# Altium schematic sheet [05]Motor.SchDoc
size A
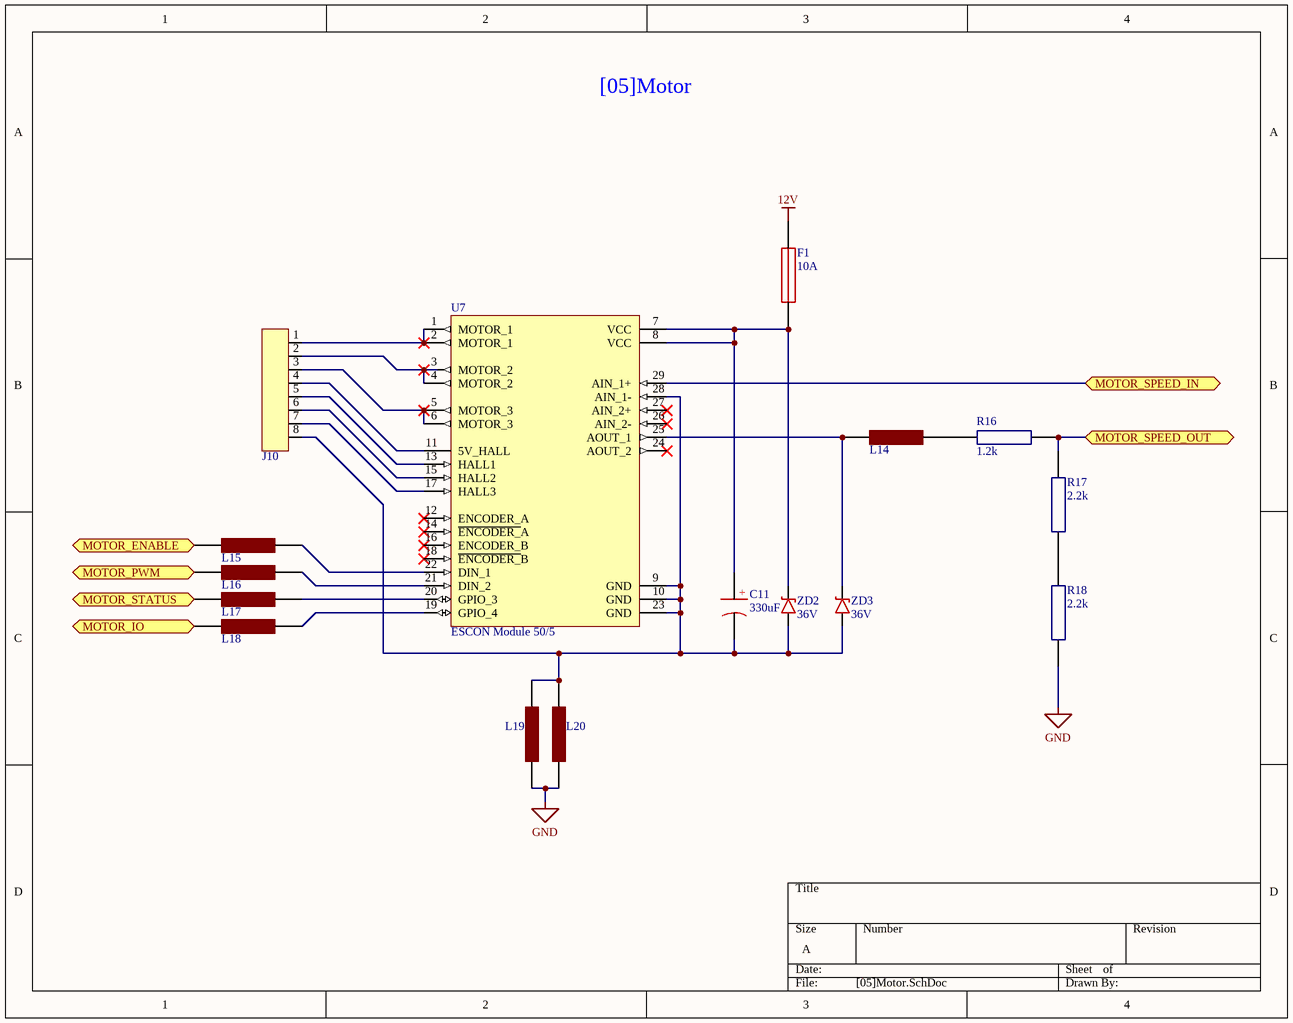
[diagram p0: [05]Motor.SchDoc]

## Parts
C11  330uF  [CAPAE137130X140M]
F1  10A  [0157004.DR]
J10  1771156  [1771156]  (value not drawn)
L14  MH2029-300Y  [INDC2012X11N]  (value not drawn)
L15  MH2029-300Y  [INDC2012X11N]  (value not drawn)
L16  MH2029-300Y  [INDC2012X11N]  (value not drawn)
L17  MH2029-300Y  [INDC2012X11N]  (value not drawn)
L18  MH2029-300Y  [INDC2012X11N]  (value not drawn)
L19  MH2029-300Y  [INDC2012X11N]  (value not drawn)
L20  MH2029-300Y  [INDC2012X11N]  (value not drawn)
R16  1.2k  [RESC2012X07N_SAMSUNG]
R17  2.2k  [RESC2012X07N_SAMSUNG]
R18  2.2k  [RESC2012X07N_SAMSUNG]
U7  ESCON Module 50/5  [ESCON Module 50/5 SMD]
ZD2  36V  [SOT95P237X111-3N]
ZD3  36V  [SOT95P237X111-3N]

## Ports
MOTOR_ENABLE (bidir), MOTOR_IO (bidir), MOTOR_PWM (bidir), MOTOR_SPEED_IN (bidir), MOTOR_SPEED_OUT (bidir), MOTOR_STATUS (bidir)

## Nets
12V: F1.2
GND: L19.2 L20.1 R18.1
MOTOR_ENABLE: L15.1 ; port MOTOR_ENABLE
MOTOR_IO: L18.1 ; port MOTOR_IO
MOTOR_PWM: L16.1 ; port MOTOR_PWM
MOTOR_SPEED_IN: U7.29(AIN_1+) ; port MOTOR_SPEED_IN
MOTOR_SPEED_OUT: R16.1 R17.2 ; port MOTOR_SPEED_OUT
MOTOR_STATUS: L17.1 ; port MOTOR_STATUS
NetC11_1: C11.1 F1.1 U7.7(VCC) U7.8(VCC) ZD2.K
NetC11_2: C11.2 J10.8 L19.1 L20.2 U7.9(GND) U7.10(GND) U7.23(GND) U7.28(AIN_1-) ZD2.A ZD3.A
NetJ10_1: J10.1 U7.1(MOTOR_1) U7.2(MOTOR_1)
NetJ10_2: J10.2 U7.3(MOTOR_2) U7.4(MOTOR_2)
NetJ10_3: J10.3 U7.5(MOTOR_3) U7.6(MOTOR_3)
NetJ10_4: J10.4 U7.11(5V_HALL)
NetJ10_5: J10.5 U7.13(HALL1)
NetJ10_6: J10.6 U7.15(HALL2)
NetJ10_7: J10.7 U7.17(HALL3)
NetL14_1: L14.1 U7.25(AOUT_1) ZD3.K
NetL14_2: L14.2 R16.2
NetL15_2: L15.2 U7.22(DIN_1)
NetL16_2: L16.2 U7.21(DIN_2)
NetL17_2: L17.2 U7.20(GPIO_3)
NetL18_2: L18.2 U7.19(GPIO_4)
NetR17_1: R17.1 R18.2

Not connected (* = marked no-connect by the designer): U7 12(ENCODER_A)* 14(~{ENCODER_}A)* 16(ENCODER_B)* 18(~{ENCODER_}B)* 24(AOUT_2)* 26(AIN_2-)* 27(AIN_2+)*

## Notes on the sheet
- [05]Motor
- (in symbol EMVH350ARA331MKE0S) +

## Library data of the parts
C11 = EMVH350ARA331MKE0S: CAP ALUM 330UF 20% 35V SMD; Supplier 1: Digi-Key; Supplier Part Number 1: 565-2316-1-ND
F1 = 0157010.DR: FUSE BRD MNT 10A 125VAC/VDC SMD; Manufacturer: Littelfuse Inc.; Fuse Type: Board Mount (Cartridge Style Excluded); Response Time: Fast; Breaking Capacity @ Rated Voltage: 35A AC, 50A DC; Approvals: cULus, PSE; Supplier 1: Digi-Key; Manufacturer Part Number: 0157010.DR; RoHS: RoHS Compliant; Category: Circuit Protection; Stock 1: 6229; Pricing 1: 1=2.73, 5=2.6, 10=2.47, 50=1.9936, 100=1.6903, 250=1.64692, 500=1.38688 (USD); Packaging: Cut Tape (CT); Part Status: Active; Package / Case: 2-SMD, Square End Block with Clip; Mounting Type: Holder, Surface Mount; Operating Temperature: -55°C ~ 125°C; Color: -; Size / Dimension: 0.256" L x 0.146" W x 0.154" H (6.50mm x 3.70mm x 3.90mm); ComponentLink1URL: http://www.littelfuse.com/products/fuse-blocks-fuseholders-and-fuse-accessories/fuse-clips/~/media/electronics/datasheets/fuses/littelfuse_fuse_157_datasheet.pdf.pdf; ComponentLink1Description: http://www.littelfuse.com/products/fuse-blocks-fuseholders-and-fuse-accessories/fuse-clips/~/media/electronics/datasheets/fuses/littelfuse_fuse_157_datasheet.pdf.pdf; Supplier Part Number 1: F2973CT-ND
J10 = 1771156: CONN TERM BLK 8POS 2.5MM SMD; Manufacturer: Phoenix Contact; Positions Per Level: 8; Pitch: 0.098" (2.50mm); Mating Orientation: Vertical with Board; Wire Gauge: 20-26 AWG; Wire Termination: Screwless - Spring Cage, Tension Clamp; Supplier 1: Digi-Key; Manufacturer Part Number: 1771156; RoHS: RoHS Compliant; Category: Connectors, Interconnects; Stock 1: 2856; Pricing 1: 1=1.39, 10=1.334, 50=1.276, 100=1.2412 (USD); Packaging: Cut Tape (CT); Part Status: Active; Mounting Type: Surface Mount; Features: Solder Retention; Color: Black; Operating Temperature: -; Housing Material: Liquid Crystal Polymer (LCP); Contact Material - Plating: -; Clamp Material - Plating: -; Screw Material - Plating: -; Torque - Screw: -; Screw Thread: -; ComponentLink1URL: https://media.digikey.com/pdf/Data%20Sheets/Phoenix%20Contact%20PDFs/1771156.pdf; ComponentLink1Description: https://media.digikey.com/pdf/Data%20Sheets/Phoenix%20Contact%20PDFs/1771156.pdf; Supplier Part Number 1: 277-2078-1-ND
L14-L20 = MH2029-300Y: EMI Filter Beads, Chips & Arrays Impedance 30ohms IDC 3.0; Manufacturer: Bourns; Maximum DC Current: 3 A; Maximum DC Resistance: 25 mOhms; Tolerance: 25 %; Type: High Current Chip Ferrite Bead; Test Frequency: 100 MHz; Filter Type: Power, Signal Line; Number of Lines: 1; Impedance @ Frequency: 30 Ohm @ 100MHz; Current Rating (Max): 3A; DC Resistance (DCR) (Max): 25 mOhm; Manufacturer Part Number: MH2029-300Y; RoHS: RoHS Compliant; Category: EMI Filter Beads, Chips & Arrays; Pricing 1: 1=0.1, 10=0.062, 25=0.0568, 50=0.051, 100=0.0375, 250=0.02724, 500=0.02498, 1000=0.02157 (USD); Capacitance: -; Height: 0.9 mm; Impedance: 30 Ohms; Length: 2 mm; Operating Temperature Range: - 55 C to + 125 C; Package / Case: 0805 (2012 metric); Packaging: Reel; Product: Ferrite Chip Beads; Termination Style: SMD/SMT; Width: 1.2 mm; Brand: Bourns; Product Category: SMD Ferrite Bead; Standard Pack Qty: 4000; RoHS - Mouser: Y; Minimum Order Quantity: 1; Reeling: True; ComponentLink1URL: http://www.mouser.com/ds/2/54/h-777565.pdf; ComponentLink1Description: http://www.mouser.com/ds/2/54/h-777565.pdf; Supplier 1: Digi-Key; Stock 1: 62738; Ratings: -; Operating Temperature: -55°C ~ 125°C; Mounting Type: Surface Mount; Height (Max): 0.043" (1.10mm); Size / Dimension: 0.079" L x 0.047" W (2.00mm x 1.20mm); ComponentLink2URL: http://www.bourns.com/docs/Product-Datasheets/mh.pdf; ComponentLink2Description: http://www.bourns.com/docs/Product-Datasheets/mh.pdf; Supplier Part Number 1: MH2029-300YCT-ND
R16 = RC2012F122CS: RES SMD 1.2K OHM 1% 1/8W 0805; Manufacturer: Samsung Electro-Mechanics America, Inc.; Manufacturer Part Number: RC2012F103CS; Resistance (Ohms): 10k; Power (Watts): 0.125W, 1/8W; Temperature Coefficient: ±100ppm/°C; RoHS: RoHS Compliant; Category: Resistors; Packaging: Cut Tape (CT); Tolerance: ±1%; Composition: Thick Film; Features: Moisture Resistant; Operating Temperature: -55°C ~ 155°C; Package / Case: 0805 (2012 Metric); Supplier Device Package: 0805 (2012 Metric); Size / Dimension: 0.079" L x 0.049" W (2.00mm x 1.25mm); Height: 0.024" (0.60mm); Number of Terminations: 2; ComponentLink1URL: http://media.digikey.com/pdf/Data%20Sheets/Samsung%20PDFs/RC_Series_ds.pdf; ComponentLink1Description: http://media.digikey.com/pdf/Data%20Sheets/Samsung%20PDFs/RC_Series_ds.pdf; Supplier 1: Digi-Key; Supplier Part Number 1: 1276-5275-1-ND
R17 R18 = RC2012F222CS: RES SMD 2.2K OHM 1% 1/8W 0805; Manufacturer: Samsung Electro-Mechanics America, Inc.; Manufacturer Part Number: RC2012F103CS; Resistance (Ohms): 10k; Power (Watts): 0.125W, 1/8W; Temperature Coefficient: ±100ppm/°C; RoHS: RoHS Compliant; Category: Resistors; Packaging: Cut Tape (CT); Tolerance: ±1%; Composition: Thick Film; Features: Moisture Resistant; Operating Temperature: -55°C ~ 155°C; Package / Case: 0805 (2012 Metric); Supplier Device Package: 0805 (2012 Metric); Size / Dimension: 0.079" L x 0.049" W (2.00mm x 1.25mm); Height: 0.024" (0.60mm); Number of Terminations: 2; ComponentLink1URL: http://media.digikey.com/pdf/Data%20Sheets/Samsung%20PDFs/RC_Series_ds.pdf; ComponentLink1Description: http://media.digikey.com/pdf/Data%20Sheets/Samsung%20PDFs/RC_Series_ds.pdf; Supplier 1: Digi-Key; Supplier Part Number 1: 1276-5290-1-ND
U7 = ESCON Module 50/5: 4-Q servo controller for DC/EC motors, 2/6 A, 10-50 VDC; Supplier 1: Digi-Key; Supplier 2: Digi-Key; Supplier Part Number 1: SAM1152-11-ND; Supplier Part Number 2: SAM1146-09-ND
ZD2 ZD3 = BZX84C36LT1G: Zener Diode 36V 225mW ±6%; pin to pad: A>1 K>3; Supplier 1: Digi-Key; Supplier Part Number 1: BZX84C36LT1GOSCT-ND